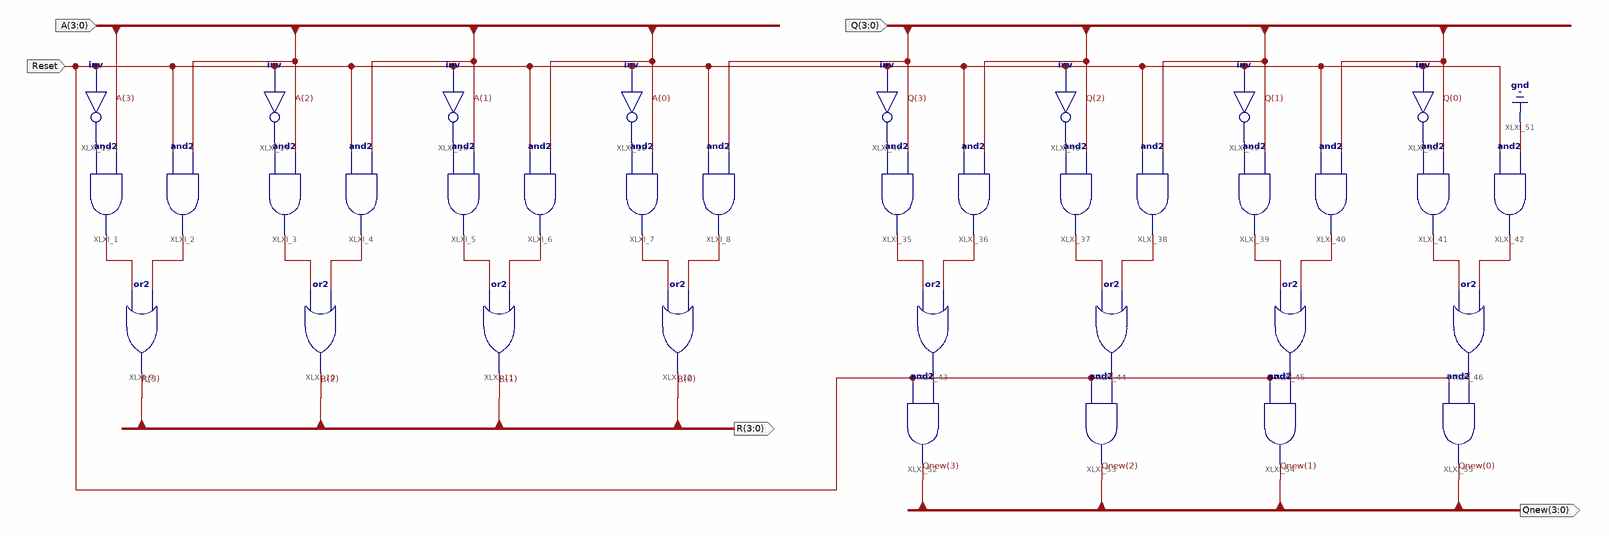
[diagram p0: schematic sheet 1]
// Xilinx ISE schematic LeftShift8Bit.sch (artix7) as structural Verilog: 36 symbols, 5 ports
module LeftShift8Bit (
  input  [3:0] A,
  input  [3:0] Q,
  input  Reset,
  output [3:0] R,
  output [3:0] Qnew
);

  wire XLXN_2, XLXN_3, XLXN_4, XLXN_5, XLXN_6, XLXN_7, XLXN_8, XLXN_9, XLXN_10, XLXN_11, XLXN_12, XLXN_13,
       XLXN_61, XLXN_62, XLXN_63, XLXN_64, XLXN_65, XLXN_66, XLXN_67, XLXN_68, XLXN_69, XLXN_70, XLXN_71,
       XLXN_72, XLXN_93, XLXN_94, XLXN_95, XLXN_96;

  and XLXI_1 (XLXN_6, XLXN_2, A[3]);
  and XLXI_2 (XLXN_7, Reset, A[2]);
  and XLXI_3 (XLXN_8, XLXN_3, A[2]);
  and XLXI_4 (XLXN_9, Reset, A[1]);
  and XLXI_5 (XLXN_10, XLXN_4, A[1]);
  and XLXI_6 (XLXN_11, Reset, A[0]);
  and XLXI_7 (XLXN_12, XLXN_5, A[0]);
  and XLXI_8 (XLXN_13, Reset, Q[3]);
  or XLXI_9 (R[3], XLXN_6, XLXN_7);
  or XLXI_10 (R[2], XLXN_8, XLXN_9);
  or XLXI_11 (R[1], XLXN_10, XLXN_11);
  or XLXI_12 (R[0], XLXN_12, XLXN_13);
  not XLXI_13 (XLXN_2, Reset);
  not XLXI_14 (XLXN_3, Reset);
  not XLXI_15 (XLXN_4, Reset);
  not XLXI_16 (XLXN_5, Reset);
  and XLXI_35 (XLXN_65, XLXN_61, Q[3]);
  and XLXI_36 (XLXN_66, Reset, Q[2]);
  and XLXI_37 (XLXN_67, XLXN_62, Q[2]);
  and XLXI_38 (XLXN_68, Reset, Q[1]);
  and XLXI_39 (XLXN_69, XLXN_63, Q[1]);
  and XLXI_40 (XLXN_70, Reset, Q[0]);
  and XLXI_41 (XLXN_71, XLXN_64, Q[0]);
  and XLXI_42 (XLXN_72, Reset, 1'b0);
  or XLXI_43 (XLXN_93, XLXN_65, XLXN_66);
  or XLXI_44 (XLXN_94, XLXN_67, XLXN_68);
  or XLXI_45 (XLXN_96, XLXN_69, XLXN_70);
  or XLXI_46 (XLXN_95, XLXN_71, XLXN_72);
  not XLXI_47 (XLXN_61, Reset);
  not XLXI_48 (XLXN_62, Reset);
  not XLXI_49 (XLXN_63, Reset);
  not XLXI_50 (XLXN_64, Reset);
  and XLXI_52 (Qnew[3], Reset, XLXN_93);
  and XLXI_53 (Qnew[2], Reset, XLXN_94);
  and XLXI_54 (Qnew[1], Reset, XLXN_96);
  and XLXI_55 (Qnew[0], Reset, XLXN_95);
endmodule
